# EAGLE design xen_matrix_panel (EAGLE 9.6.0)
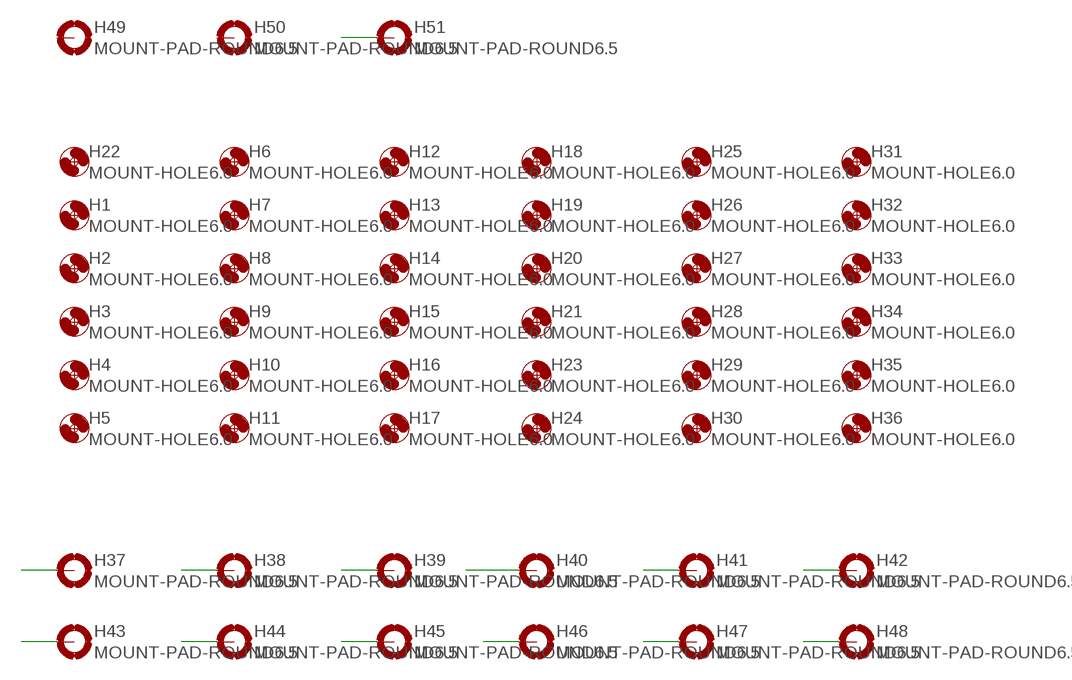
[diagram p0: schematic, sheet 1]

## Parts
H1  MOUNT-HOLE6.0  [6,0]
H2  MOUNT-HOLE6.0  [6,0]
H3  MOUNT-HOLE6.0  [6,0]
H4  MOUNT-HOLE6.0  [6,0]
H5  MOUNT-HOLE6.0  [6,0]
H6  MOUNT-HOLE6.0  [6,0]
H7  MOUNT-HOLE6.0  [6,0]
H8  MOUNT-HOLE6.0  [6,0]
H9  MOUNT-HOLE6.0  [6,0]
H10  MOUNT-HOLE6.0  [6,0]
H11  MOUNT-HOLE6.0  [6,0]
H12  MOUNT-HOLE6.0  [6,0]
H13  MOUNT-HOLE6.0  [6,0]
H14  MOUNT-HOLE6.0  [6,0]
H15  MOUNT-HOLE6.0  [6,0]
H16  MOUNT-HOLE6.0  [6,0]
H17  MOUNT-HOLE6.0  [6,0]
H18  MOUNT-HOLE6.0  [6,0]
H19  MOUNT-HOLE6.0  [6,0]
H20  MOUNT-HOLE6.0  [6,0]
H21  MOUNT-HOLE6.0  [6,0]
H22  MOUNT-HOLE6.0  [6,0]
H23  MOUNT-HOLE6.0  [6,0]
H24  MOUNT-HOLE6.0  [6,0]
H25  MOUNT-HOLE6.0  [6,0]
H26  MOUNT-HOLE6.0  [6,0]
H27  MOUNT-HOLE6.0  [6,0]
H28  MOUNT-HOLE6.0  [6,0]
H29  MOUNT-HOLE6.0  [6,0]
H30  MOUNT-HOLE6.0  [6,0]
H31  MOUNT-HOLE6.0  [6,0]
H32  MOUNT-HOLE6.0  [6,0]
H33  MOUNT-HOLE6.0  [6,0]
H34  MOUNT-HOLE6.0  [6,0]
H35  MOUNT-HOLE6.0  [6,0]
H36  MOUNT-HOLE6.0  [6,0]
H37  MOUNT-PAD-ROUND6.5  [6.5-PAD]
H38  MOUNT-PAD-ROUND6.5  [6.5-PAD]
H39  MOUNT-PAD-ROUND6.5  [6.5-PAD]
H40  MOUNT-PAD-ROUND6.5  [6.5-PAD]
H41  MOUNT-PAD-ROUND6.5  [6.5-PAD]
H42  MOUNT-PAD-ROUND6.5  [6.5-PAD]
H43  MOUNT-PAD-ROUND6.5  [6.5-PAD]
H44  MOUNT-PAD-ROUND6.5  [6.5-PAD]
H45  MOUNT-PAD-ROUND6.5  [6.5-PAD]
H46  MOUNT-PAD-ROUND6.5  [6.5-PAD]
H47  MOUNT-PAD-ROUND6.5  [6.5-PAD]
H48  MOUNT-PAD-ROUND6.5  [6.5-PAD]
H49  MOUNT-PAD-ROUND6.5  [6.5-PAD]
H50  MOUNT-PAD-ROUND6.5  [6.5-PAD]
H51  MOUNT-PAD-ROUND6.5  [6.5-PAD]

## Nets
N$1: H37.B6.5(MOUNT)
N$2: H44.B6.5(MOUNT)
N$3: H39.B6.5(MOUNT)
N$4: H40.B6.5(MOUNT)
N$5: H45.B6.5(MOUNT)
N$6: H42.B6.5(MOUNT)
N$7: H43.B6.5(MOUNT)
N$8: H46.B6.5(MOUNT)
N$9: H47.B6.5(MOUNT)
N$10: H51.B6.5(MOUNT)
N$12: H48.B6.5(MOUNT)
N$13: H38.B6.5(MOUNT)
N$14: H41.B6.5(MOUNT)
Unconnected: H49.B6.5(MOUNT) H50.B6.5(MOUNT)

## Library data of the parts
H1-H36 = holes:MOUNT-HOLE: MOUNTING HOLE with drill center marker
H37-H51 = holes:MOUNT-PAD-ROUND: MOUNTING PAD, round

## Board
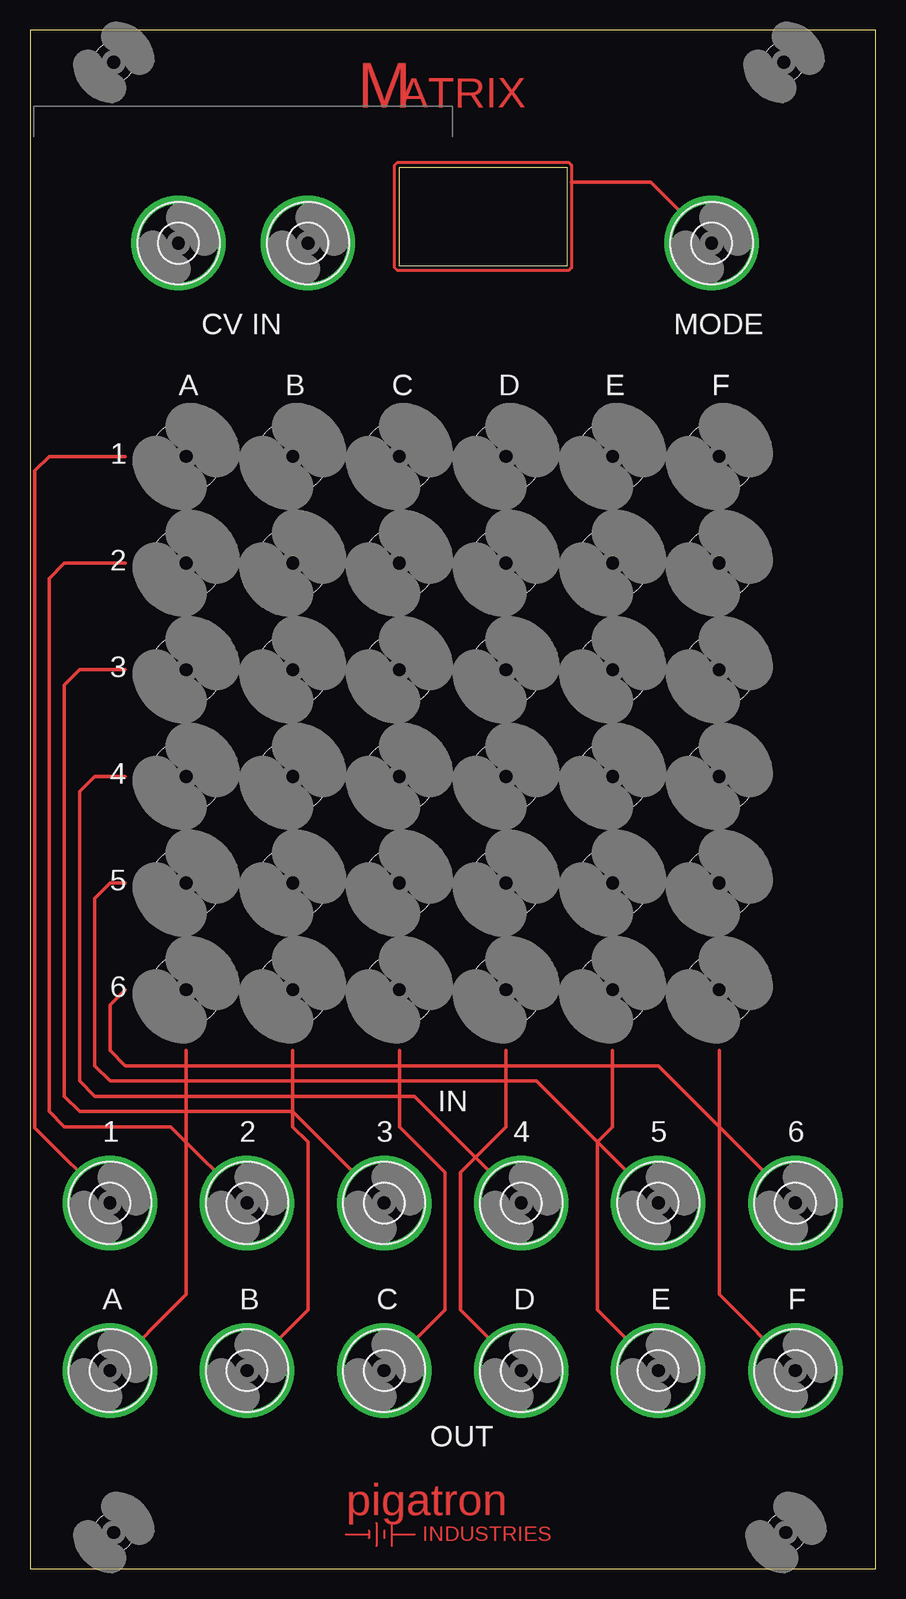
[diagram p1: board, top side]

Size 70.54 x 128.26 mm. Coordinates in mm from the lower left corner, seen from the top.
Outline: 0,0 70.54,0 70.54,128.26 0,128.26 0,0
Outline: 30.8,116.84 44.77,116.84 44.77,108.58 30.8,108.58 30.8,116.84
Copper layers (1*16): Top 0.0356mm / dielectric 1.5011mm / Bottom 0.0356mm
Design rules "pigatron *": minimum track width 8mil, minimum drill 13mil, track to track 8mil, track to pad 8mil, pad to pad 8mil, via to via 8mil, smd to smd 6mil, copper to edge 10mil, drill to drill 10mil, minimum pad ring 12mil, minimum via ring 10mil, stop-mask expansion 4mil, vias tented up to drill 0mil, thermal gap 10mil

### Footprints (pad centres in the part's own frame; a part is rotated, then mirrored left to right if it is on the bottom)
6,0 = hole 6: 0,0
6.5-PAD = drill 6.502 pad 7.874: B6.5 0,0
3,3 = hole 3.3: 0,0

### Placement (x,y rotation side)
H1  21.91,92.71 0 top
H2  30.8,92.71 0 top
H3  39.69,92.71 0 top
H4  48.58,92.71 0 top
H5  57.47,92.71 0 top
H6  13.02,83.82 0 top
H7  21.91,83.82 0 top
H8  30.8,83.82 0 top
H9  39.69,83.82 0 top
H10  48.58,83.82 0 top
H11  57.47,83.82 0 top
H12  13.02,74.93 0 top
H13  21.91,74.93 0 top
H14  30.8,74.93 0 top
H15  39.69,74.93 0 top
H16  48.58,74.93 0 top
H17  57.47,74.93 0 top
H18  13.02,66.04 0 top
H19  21.91,66.04 0 top
H20  30.8,66.04 0 top
H21  39.69,66.04 0 top
H22  13.02,92.71 0 top
H23  48.58,66.04 0 top
H24  57.47,66.04 0 top
H25  13.02,57.15 0 top
H26  21.91,57.15 0 top
H27  30.8,57.15 0 top
H28  39.69,57.15 0 top
H29  48.58,57.15 0 top
H30  57.47,57.15 0 top
H31  13.02,48.26 0 top
H32  21.91,48.26 0 top
H33  30.8,48.26 0 top
H34  39.69,48.26 0 top
H35  48.58,48.26 0 top
H36  57.47,48.26 0 top
H37  6.67,30.48 0 top
H38  18.1,30.48 0 top
H39  29.53,30.48 0 top
H40  40.96,30.48 0 top
H41  52.39,30.48 0 top
H42  63.82,30.48 0 top
H43  6.67,16.51 0 top
H44  18.1,16.51 0 top
H45  29.53,16.51 0 top
H46  40.96,16.51 0 top
H47  52.39,16.51 0 top
H48  63.82,16.51 0 top
H49  12.38,110.49 0 top
H50  23.18,110.49 0 top
H51  56.83,110.49 0 top
U$2  [3,3]  62.87,125.57 0 top
U$3  [3,3]  6.99,125.57 0 top
U$4  [3,3]  63.02,3.02 0 top
U$5  [3,3]  6.99,3.02 0 top
U$6  [PIGATRON-LOGO-TRACE]  35.24,4.45 0 top

### Tracks (layer width: path | path; a pad name or v marks a point on that pad's centre or on a via)
N$1
  Top 0.305: H37.B6.5 0.41,36.74 0.41,91.53 1.59,92.71 7.94,92.71
N$2
  Top 0.305: 21.91,43.18 21.91,36.83 23.18,35.56 23.18,21.59 H44.B6.5
N$3
  Top 0.305: H39.B6.5 21.91,38.1 4.13,38.1 2.86,39.37 2.86,73.66 4.13,74.93 7.94,74.93
N$4
  Top 0.305: H40.B6.5 32.07,39.37 5.4,39.37 4.13,40.64 4.13,64.77 5.4,66.04 7.94,66.04
N$5
  Top 0.305: 30.8,43.18 30.8,36.83 34.61,33.02 34.61,21.59 H45.B6.5
N$6
  Top 0.305: H42.B6.5 52.39,41.91 7.94,41.91 6.67,43.18 6.67,46.99 7.94,48.26
N$7
  Top 0.305: 13.02,43.18 13.02,22.86 H43.B6.5
N$8
  Top 0.305: H46.B6.5 35.88,21.59 35.88,33.02 39.69,36.83 39.69,43.18
N$9
  Top 0.305: H47.B6.5 47.31,21.59 47.31,35.56 48.58,36.83 48.58,43.18
N$10
  Top 0.254: 30.42,117 30.64,117.22 44.93,117.22 45.15,117 45.15,115.57 45.15,108.43 44.93,108.2 30.64,108.2 30.42,108.43 30.42,117
  Top 0.305: H51.B6.5 51.75,115.57 45.15,115.57
N$12
  Top 0.305: 57.47,43.18 57.47,22.86 H48.B6.5
N$13
  Top 0.305: 7.94,83.82 2.86,83.82 1.59,82.55 1.59,38.1 2.86,36.83 11.75,36.83 H38.B6.5
N$14
  Top 0.305: H41.B6.5 42.23,40.64 6.67,40.64 5.4,41.91 5.4,55.88 6.67,57.15 7.94,57.15

### Text on the board
Top: M | ATRIX
tNames: CV IN | MODE | A | B | C | D | E | F | 1 | 2 | 3 | 4 | 5 | 6 | IN | 1 | 2 | 3 | 4 | 5 | 6 | A | B | C | D | E | F | OUT
bNames: Rob Ellis 2022
tStop: M | ATRIX